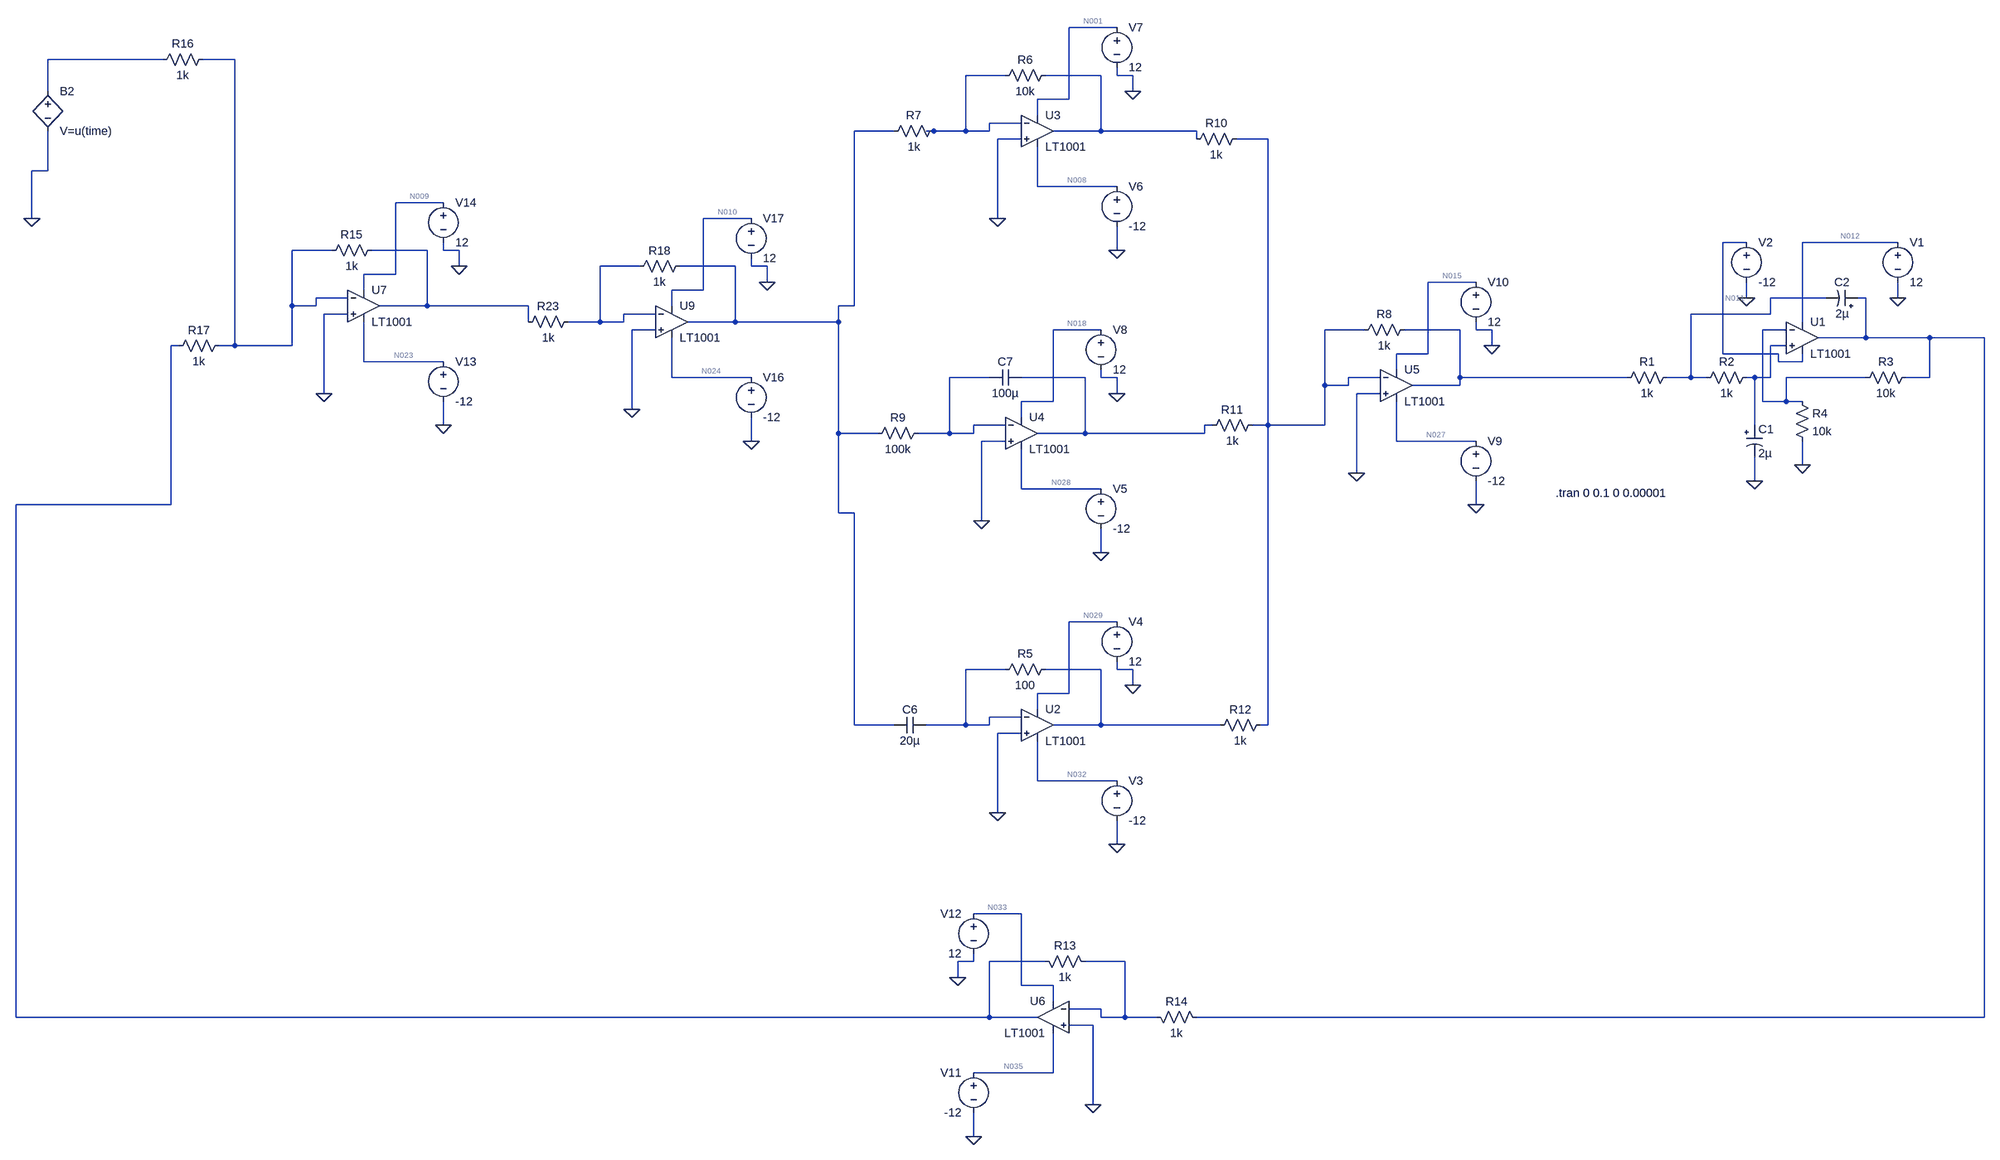
[diagram p0: schematic PID_Controller.asc]
PID_Controller.asc, the LTspice schematic file:
Version 4
SHEET 1 4088 1172
WIRE -544 -1360 -640 -1360
WIRE -3408 -1296 -3648 -1296
WIRE -3264 -1296 -3328 -1296
WIRE -768 -1264 -848 -1264
WIRE -576 -1264 -688 -1264
WIRE -544 -1264 -544 -1280
WIRE -512 -1264 -544 -1264
WIRE -3648 -1232 -3648 -1296
WIRE -512 -1232 -512 -1264
WIRE -640 -1216 -640 -1360
WIRE -640 -1216 -704 -1216
WIRE -704 -1184 -704 -1216
WIRE -736 -1168 -800 -1168
WIRE -992 -1152 -1072 -1152
WIRE -912 -1152 -928 -1152
WIRE -848 -1152 -848 -1264
WIRE -848 -1152 -912 -1152
WIRE -800 -1152 -800 -1168
WIRE -800 -1152 -848 -1152
WIRE -576 -1152 -576 -1264
WIRE -576 -1152 -672 -1152
WIRE -384 -1152 -576 -1152
WIRE -736 -1136 -784 -1136
WIRE -384 -1136 -384 -1152
WIRE -240 -1136 -304 -1136
WIRE -3648 -1072 -3648 -1152
WIRE -3648 -1072 -3680 -1072
WIRE -704 -1040 -704 -1120
WIRE -544 -1040 -704 -1040
WIRE -2768 -1008 -2864 -1008
WIRE -3680 -976 -3680 -1072
WIRE -1824 -976 -1920 -976
WIRE -784 -976 -784 -1136
WIRE 800 -928 752 -928
WIRE 1104 -928 912 -928
WIRE -2992 -912 -3072 -912
WIRE -2800 -912 -2912 -912
WIRE -2768 -912 -2768 -928
WIRE -2736 -912 -2768 -912
WIRE -544 -912 -544 -960
WIRE -2736 -880 -2736 -912
WIRE -2048 -880 -2128 -880
WIRE -1856 -880 -1968 -880
WIRE -1824 -880 -1824 -896
WIRE -1792 -880 -1824 -880
WIRE -2864 -864 -2864 -1008
WIRE -2864 -864 -2928 -864
WIRE -1792 -848 -1792 -880
WIRE 256 -848 160 -848
WIRE -2928 -832 -2928 -864
WIRE -1920 -832 -1920 -976
WIRE -1920 -832 -1984 -832
WIRE -2960 -816 -3024 -816
WIRE 800 -816 800 -848
WIRE 960 -816 848 -816
WIRE 1040 -816 1024 -816
WIRE 1104 -816 1104 -848
WIRE -3072 -800 -3072 -912
WIRE -3024 -800 -3024 -816
WIRE -3024 -800 -3072 -800
WIRE -2800 -800 -2800 -912
WIRE -2800 -800 -2896 -800
WIRE -2272 -800 -2800 -800
WIRE -1984 -800 -1984 -832
WIRE -1072 -800 -1072 -1152
WIRE -1072 -800 -1104 -800
WIRE -2960 -784 -3008 -784
WIRE -2016 -784 -2080 -784
WIRE 848 -784 848 -816
WIRE 848 -784 688 -784
WIRE -2272 -768 -2272 -800
WIRE -2128 -768 -2128 -880
WIRE -2128 -768 -2192 -768
WIRE -2080 -768 -2080 -784
WIRE -2080 -768 -2128 -768
WIRE -1856 -768 -1856 -880
WIRE -1856 -768 -1952 -768
WIRE -1104 -768 -1104 -800
WIRE -1104 -768 -1856 -768
WIRE 912 -768 912 -928
WIRE -2016 -752 -2064 -752
WIRE -576 -752 -672 -752
WIRE 32 -752 -48 -752
WIRE 224 -752 112 -752
WIRE 256 -752 256 -768
WIRE 288 -752 256 -752
WIRE 880 -752 832 -752
WIRE 1040 -736 1040 -816
WIRE 1040 -736 944 -736
WIRE 1168 -736 1040 -736
WIRE 1408 -736 1168 -736
WIRE -3376 -720 -3392 -720
WIRE -3264 -720 -3264 -1296
WIRE -3264 -720 -3296 -720
WIRE -3072 -720 -3072 -800
WIRE -3072 -720 -3264 -720
WIRE 288 -720 288 -752
WIRE 880 -720 848 -720
WIRE 160 -704 160 -848
WIRE 160 -704 96 -704
WIRE 752 -704 752 -928
WIRE 864 -704 752 -704
WIRE -2928 -688 -2928 -768
WIRE -2768 -688 -2928 -688
WIRE 864 -688 864 -704
WIRE 912 -688 912 -704
WIRE 912 -688 864 -688
WIRE 96 -672 96 -704
WIRE -1984 -656 -1984 -736
WIRE -1824 -656 -1984 -656
WIRE -800 -656 -880 -656
WIRE -608 -656 -736 -656
WIRE -576 -656 -576 -672
WIRE -544 -656 -576 -656
WIRE 64 -656 0 -656
WIRE 224 -656 224 -752
WIRE 560 -656 224 -656
WIRE 688 -656 688 -784
WIRE 688 -656 640 -656
WIRE 720 -656 688 -656
WIRE 816 -656 800 -656
WIRE 848 -656 848 -720
WIRE 848 -656 816 -656
WIRE 1040 -656 880 -656
WIRE 1168 -656 1168 -736
WIRE 1168 -656 1120 -656
WIRE -48 -640 -48 -752
WIRE 0 -640 0 -656
WIRE 0 -640 -48 -640
WIRE 224 -640 224 -656
WIRE 224 -640 128 -640
WIRE -3008 -624 -3008 -784
WIRE -544 -624 -544 -656
WIRE 64 -624 16 -624
WIRE -672 -608 -672 -752
WIRE -672 -608 -736 -608
WIRE 832 -608 832 -752
WIRE 880 -608 880 -656
WIRE 880 -608 832 -608
WIRE 912 -608 880 -608
WIRE -2064 -592 -2064 -752
WIRE -736 -576 -736 -608
WIRE -2768 -560 -2768 -608
WIRE -768 -560 -832 -560
WIRE -352 -560 -368 -560
WIRE -240 -560 -240 -1136
WIRE -240 -560 -272 -560
WIRE -48 -560 -48 -640
WIRE -48 -560 -240 -560
WIRE 816 -560 816 -656
WIRE -1104 -544 -1104 -768
WIRE -1024 -544 -1104 -544
WIRE -880 -544 -880 -656
WIRE -880 -544 -944 -544
WIRE -832 -544 -832 -560
WIRE -832 -544 -880 -544
WIRE -608 -544 -608 -656
WIRE -608 -544 -704 -544
WIRE -368 -544 -368 -560
WIRE -368 -544 -608 -544
WIRE -1824 -528 -1824 -576
WIRE -768 -528 -816 -528
WIRE 96 -528 96 -608
WIRE 256 -528 96 -528
WIRE 912 -480 912 -528
WIRE 16 -464 16 -624
WIRE 816 -448 816 -496
WIRE -736 -432 -736 -512
WIRE -576 -432 -736 -432
WIRE -3392 -400 -3392 -720
WIRE -3392 -400 -3712 -400
WIRE 256 -400 256 -448
WIRE -1104 -384 -1104 -544
WIRE -1072 -384 -1104 -384
WIRE -816 -368 -816 -528
WIRE -576 -304 -576 -352
WIRE -544 -128 -640 -128
WIRE -768 -32 -848 -32
WIRE -576 -32 -688 -32
WIRE -544 -32 -544 -48
WIRE -512 -32 -544 -32
WIRE -512 0 -512 -32
WIRE -640 16 -640 -128
WIRE -640 16 -704 16
WIRE -704 48 -704 16
WIRE -736 64 -800 64
WIRE -1072 80 -1072 -384
WIRE -992 80 -1072 80
WIRE -848 80 -848 -32
WIRE -848 80 -928 80
WIRE -800 80 -800 64
WIRE -800 80 -848 80
WIRE -576 80 -576 -32
WIRE -576 80 -672 80
WIRE -336 80 -576 80
WIRE -240 80 -240 -560
WIRE -240 80 -256 80
WIRE -736 96 -784 96
WIRE -704 192 -704 112
WIRE -544 192 -704 192
WIRE -784 256 -784 96
WIRE -544 320 -544 272
WIRE -736 688 -832 688
WIRE -832 784 -832 768
WIRE -832 784 -864 784
WIRE -688 784 -800 784
WIRE -528 784 -608 784
WIRE -864 816 -864 784
WIRE -736 832 -736 688
WIRE -672 832 -736 832
WIRE -672 864 -672 832
WIRE -576 880 -640 880
WIRE -3712 896 -3712 -400
WIRE -800 896 -800 784
WIRE -800 896 -3712 896
WIRE -704 896 -800 896
WIRE -576 896 -576 880
WIRE -528 896 -528 784
WIRE -528 896 -576 896
WIRE -464 896 -528 896
WIRE 1408 896 1408 -736
WIRE 1408 896 -384 896
WIRE -592 912 -640 912
WIRE -672 1008 -672 928
WIRE -672 1008 -832 1008
WIRE -592 1072 -592 912
WIRE -832 1136 -832 1088
FLAG 800 -816 0
FLAG 1104 -816 0
FLAG 816 -448 0
FLAG 912 -480 0
FLAG -784 256 0
FLAG -512 0 0
FLAG -544 320 0
FLAG -784 -976 0
FLAG -512 -1232 0
FLAG -544 -912 0
FLAG -816 -368 0
FLAG -544 -624 0
FLAG -576 -304 0
FLAG 16 -464 0
FLAG 288 -720 0
FLAG 256 -400 0
FLAG -592 1072 0
FLAG -864 816 0
FLAG -832 1136 0
FLAG -3008 -624 0
FLAG -2736 -880 0
FLAG -2768 -560 0
FLAG -3680 -976 0
FLAG -2064 -592 0
FLAG -1792 -848 0
FLAG -1824 -528 0
SYMBOL res 656 -672 R90
WINDOW 0 0 56 VBottom 2
WINDOW 3 32 56 VTop 2
SYMATTR InstName R1
SYMATTR Value 1k
SYMBOL res 816 -672 R90
WINDOW 0 0 56 VBottom 2
WINDOW 3 32 56 VTop 2
SYMATTR InstName R2
SYMATTR Value 1k
SYMBOL res 1136 -672 R90
WINDOW 0 0 56 VBottom 2
WINDOW 3 32 56 VTop 2
SYMATTR InstName R3
SYMATTR Value 10k
SYMBOL res 896 -624 R0
SYMATTR InstName R4
SYMATTR Value 10k
SYMBOL OpAmps\\LT1001 912 -800 R0
SYMATTR InstName U1
SYMBOL voltage 1104 -944 R0
WINDOW 123 0 0 Left 0
WINDOW 39 0 0 Left 0
SYMATTR InstName V1
SYMATTR Value 12
SYMBOL voltage 800 -944 R0
WINDOW 123 0 0 Left 0
WINDOW 39 0 0 Left 0
SYMATTR InstName V2
SYMATTR Value -12
SYMBOL polcap 800 -560 R0
SYMATTR InstName C1
SYMATTR Value 2µ
SYMBOL polcap 1024 -800 M270
WINDOW 0 32 32 VTop 2
WINDOW 3 0 32 VBottom 2
SYMATTR InstName C2
SYMATTR Value 2µ
SYMBOL voltage -544 176 R0
WINDOW 123 0 0 Left 0
WINDOW 39 0 0 Left 0
SYMATTR InstName V3
SYMATTR Value -12
SYMBOL voltage -544 -144 R0
WINDOW 123 0 0 Left 0
WINDOW 39 0 0 Left 0
SYMATTR InstName V4
SYMATTR Value 12
SYMBOL OpAmps\\LT1001 -704 16 R0
SYMATTR InstName U2
SYMBOL res -672 -48 R90
WINDOW 0 0 56 VBottom 2
WINDOW 3 32 56 VTop 2
SYMATTR InstName R5
SYMATTR Value 100
SYMBOL voltage -544 -1056 R0
WINDOW 123 0 0 Left 0
WINDOW 39 0 0 Left 0
SYMATTR InstName V6
SYMATTR Value -12
SYMBOL voltage -544 -1376 R0
WINDOW 123 0 0 Left 0
WINDOW 39 0 0 Left 0
SYMATTR InstName V7
SYMATTR Value 12
SYMBOL OpAmps\\LT1001 -704 -1216 R0
SYMATTR InstName U3
SYMBOL res -672 -1280 R90
WINDOW 0 0 56 VBottom 2
WINDOW 3 32 56 VTop 2
SYMATTR InstName R6
SYMATTR Value 10k
SYMBOL res -896 -1168 R90
WINDOW 0 0 56 VBottom 2
WINDOW 3 32 56 VTop 2
SYMATTR InstName R7
SYMATTR Value 1k
SYMBOL bv -3648 -1248 R0
SYMATTR InstName B2
SYMATTR Value V=u(time)
SYMBOL voltage -576 -448 R0
WINDOW 123 0 0 Left 0
WINDOW 39 0 0 Left 0
SYMATTR InstName V5
SYMATTR Value -12
SYMBOL voltage -576 -768 R0
WINDOW 123 0 0 Left 0
WINDOW 39 0 0 Left 0
SYMATTR InstName V8
SYMATTR Value 12
SYMBOL OpAmps\\LT1001 -736 -608 R0
SYMATTR InstName U4
SYMBOL res -928 -560 R90
WINDOW 0 0 56 VBottom 2
WINDOW 3 32 56 VTop 2
SYMATTR InstName R9
SYMATTR Value 100k
SYMBOL voltage 256 -544 R0
WINDOW 123 0 0 Left 0
WINDOW 39 0 0 Left 0
SYMATTR InstName V9
SYMATTR Value -12
SYMBOL voltage 256 -864 R0
WINDOW 123 0 0 Left 0
WINDOW 39 0 0 Left 0
SYMATTR InstName V10
SYMATTR Value 12
SYMBOL OpAmps\\LT1001 96 -704 R0
SYMATTR InstName U5
SYMBOL res 128 -768 R90
WINDOW 0 0 56 VBottom 2
WINDOW 3 32 56 VTop 2
SYMATTR InstName R8
SYMATTR Value 1k
SYMBOL res -288 -1152 R90
WINDOW 0 0 56 VBottom 2
WINDOW 3 32 56 VTop 2
SYMATTR InstName R10
SYMATTR Value 1k
SYMBOL res -256 -576 R90
WINDOW 0 0 56 VBottom 2
WINDOW 3 32 56 VTop 2
SYMATTR InstName R11
SYMATTR Value 1k
SYMBOL res -240 64 R90
WINDOW 0 0 56 VBottom 2
WINDOW 3 32 56 VTop 2
SYMATTR InstName R12
SYMATTR Value 1k
SYMBOL voltage -832 992 M0
WINDOW 123 0 0 Left 0
WINDOW 39 0 0 Left 0
SYMATTR InstName V11
SYMATTR Value -12
SYMBOL voltage -832 672 M0
WINDOW 123 0 0 Left 0
WINDOW 39 0 0 Left 0
SYMATTR InstName V12
SYMATTR Value 12
SYMBOL OpAmps\\LT1001 -672 832 M0
SYMATTR InstName U6
SYMBOL res -704 768 M90
WINDOW 0 0 56 VBottom 2
WINDOW 3 32 56 VTop 2
SYMATTR InstName R13
SYMATTR Value 1k
SYMBOL res -480 880 M90
WINDOW 0 0 56 VBottom 2
WINDOW 3 32 56 VTop 2
SYMATTR InstName R14
SYMATTR Value 1k
SYMBOL voltage -2768 -704 R0
WINDOW 123 0 0 Left 0
WINDOW 39 0 0 Left 0
SYMATTR InstName V13
SYMATTR Value -12
SYMBOL voltage -2768 -1024 R0
WINDOW 123 0 0 Left 0
WINDOW 39 0 0 Left 0
SYMATTR InstName V14
SYMATTR Value 12
SYMBOL OpAmps\\LT1001 -2928 -864 R0
SYMATTR InstName U7
SYMBOL res -2896 -928 R90
WINDOW 0 0 56 VBottom 2
WINDOW 3 32 56 VTop 2
SYMATTR InstName R15
SYMATTR Value 1k
SYMBOL res -3312 -1312 R90
WINDOW 0 0 56 VBottom 2
WINDOW 3 32 56 VTop 2
SYMATTR InstName R16
SYMATTR Value 1k
SYMBOL res -3280 -736 R90
WINDOW 0 0 56 VBottom 2
WINDOW 3 32 56 VTop 2
SYMATTR InstName R17
SYMATTR Value 1k
SYMBOL voltage -1824 -672 R0
WINDOW 123 0 0 Left 0
WINDOW 39 0 0 Left 0
SYMATTR InstName V16
SYMATTR Value -12
SYMBOL voltage -1824 -992 R0
WINDOW 123 0 0 Left 0
WINDOW 39 0 0 Left 0
SYMATTR InstName V17
SYMATTR Value 12
SYMBOL OpAmps\\LT1001 -1984 -832 R0
SYMATTR InstName U9
SYMBOL res -1952 -896 R90
WINDOW 0 0 56 VBottom 2
WINDOW 3 32 56 VTop 2
SYMATTR InstName R18
SYMATTR Value 1k
SYMBOL res -2176 -784 R90
WINDOW 0 0 56 VBottom 2
WINDOW 3 32 56 VTop 2
SYMATTR InstName R23
SYMATTR Value 1k
SYMBOL cap -928 64 R90
WINDOW 0 0 32 VBottom 2
WINDOW 3 32 32 VTop 2
SYMATTR InstName C6
SYMATTR Value 20µ
SYMBOL cap -736 -672 R90
WINDOW 0 0 32 VBottom 2
WINDOW 3 32 32 VTop 2
SYMATTR InstName C7
SYMATTR Value 100µ
TEXT 416 -424 Left 2 !.tran 0 0.1 0 0.00001

The netlist it stands for:
* PID_Controller.asc
R1 N016 N019 1k
R2 N022 N016 1k
R3 N017 N020 10k
R4 N020 0 10k
XU1 N022 N020 N012 N011 N017 LT1001  ; pins In+ In- V+ V- OUT
V1 N012 0 12
V2 N011 0 -12
C1 N022 0 2µ
C2 N017 N016 2µ
V3 N032 0 -12
V4 N029 0 12
XU2 0 N030 N029 N032 N031 LT1001  ; pins In+ In- V+ V- OUT
R5 N031 N030 100
V6 N008 0 -12
V7 N001 0 12
XU3 0 N004 N001 N008 N005 LT1001  ; pins In+ In- V+ V- OUT
R6 N005 N004 10k
R7 N004 N006 1k
B2 N002 0 V=u(time)
V5 N028 0 -12
V8 N018 0 12
XU4 0 N025 N018 N028 N026 LT1001  ; pins In+ In- V+ V- OUT
R9 N025 N006 100k
V9 N027 0 -12
V10 N015 0 12
XU5 0 N007 N015 N027 N019 LT1001  ; pins In+ In- V+ V- OUT
R8 N019 N007 1k
R10 N007 N005 1k
R11 N007 N026 1k
R12 N007 N031 1k
V11 N035 0 -12
V12 N033 0 12
XU6 0 N034 N033 N035 N021 LT1001  ; pins In+ In- V+ V- OUT
R13 N021 N034 1k
R14 N034 N017 1k
V13 N023 0 -12
V14 N009 0 12
XU7 0 N003 N009 N023 N013 LT1001  ; pins In+ In- V+ V- OUT
R15 N013 N003 1k
R16 N003 N002 1k
R17 N003 N021 1k
V16 N024 0 -12
V17 N010 0 12
XU9 0 N014 N010 N024 N006 LT1001  ; pins In+ In- V+ V- OUT
R18 N006 N014 1k
R23 N014 N013 1k
C6 N030 N006 20µ
C7 N026 N025 100µ
.tran 0 0.1 0 0.00001
.lib LTC.lib
.backanno
.end

* Results of the author's LTspice run, read from the files saved beside the schematic
* Operating Point, zero values left out:
*   V(n012) = 12 V
*   V(n011) = -12 V
*   V(n032) = -12 V
*   V(n029) = 12 V
*   V(n008) = -12 V
*   V(n001) = 12 V
*   V(n028) = -12 V
*   V(n018) = 12 V
*   V(n027) = -12 V
*   V(n015) = 12 V
*   V(n035) = -12 V
*   V(n033) = 12 V
*   V(n023) = -12 V
*   V(n009) = 12 V
*   V(n024) = -12 V
*   V(n010) = 12 V
*   I(V17) = -2.25 mA
*   I(V16) = 2.25 mA
*   I(V14) = -2.25 mA
*   I(V13) = 2.25 mA
*   I(V12) = -2.25 mA
*   I(V11) = 2.25 mA
*   I(V10) = -2.25 mA
*   I(V9) = 2.25 mA
*   I(V8) = -2.25 mA
*   I(V5) = 2.25 mA
*   I(V7) = -2.25 mA
*   I(V6) = 2.25 mA
*   I(V4) = -2.25 mA
*   I(V3) = 2.25 mA
*   I(V2) = 2.25 mA
*   I(V1) = -2.25 mA